# Altium project MIA_H_Bridge.PrjPcb
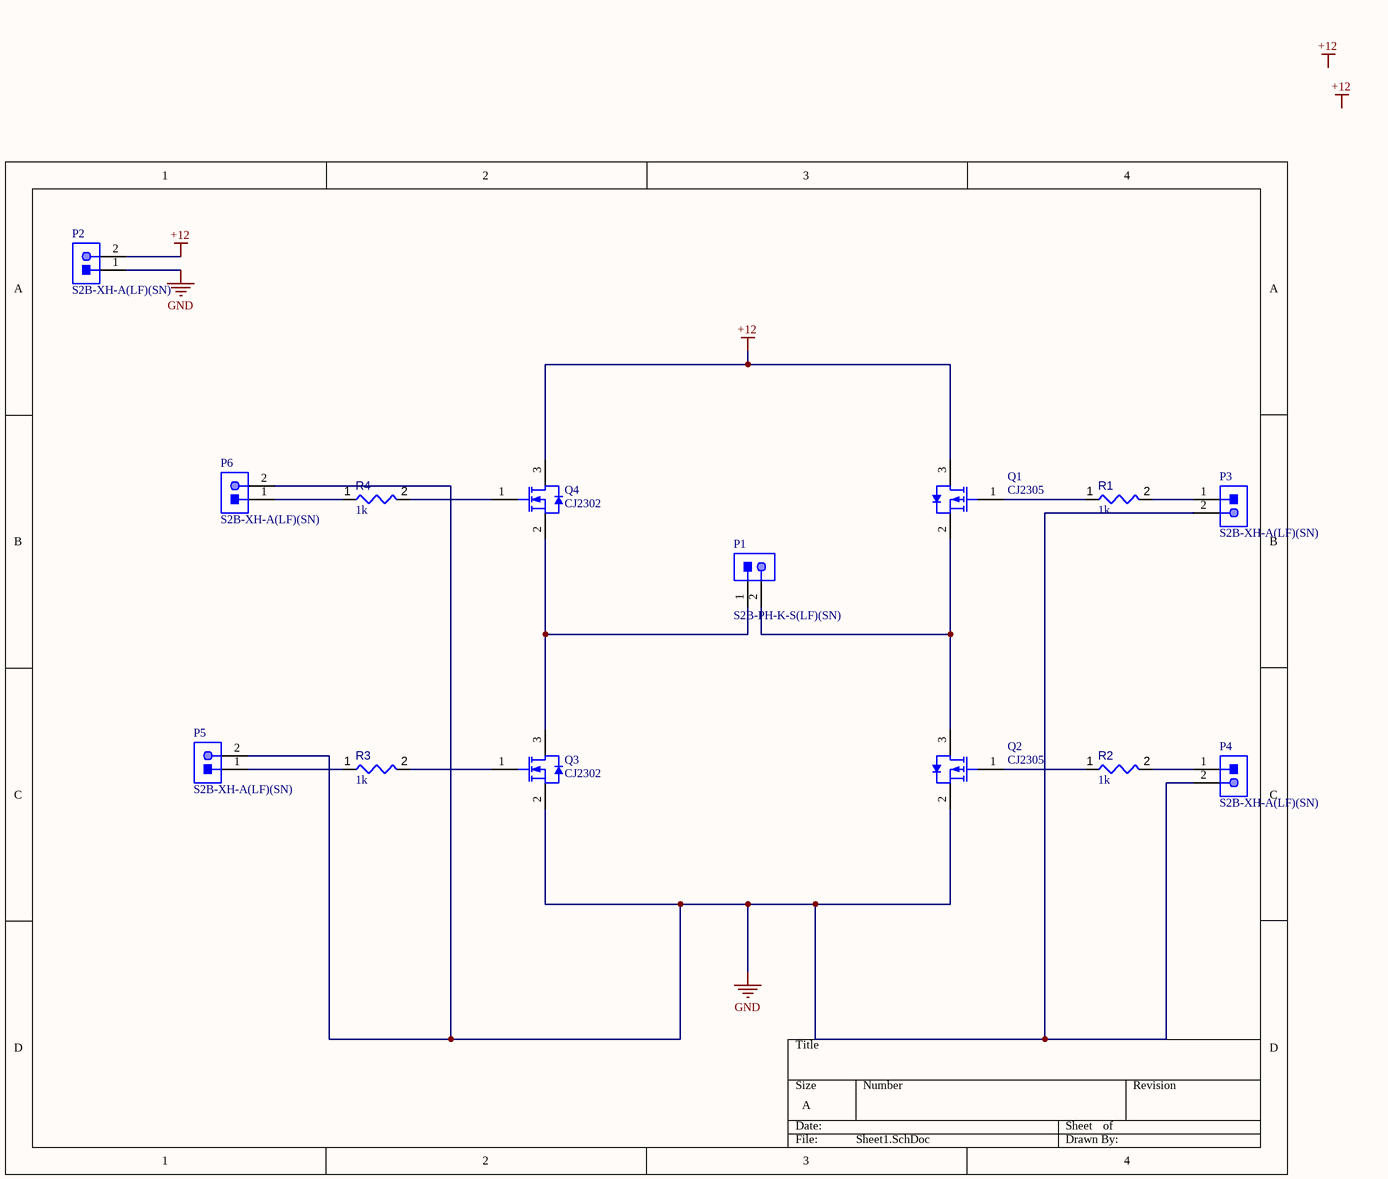
[diagram p0: Sheet1.SchDoc]
1 sheet, 14 parts. Net scope: global (net labels, ports and power ports of the same name join across sheets).
Board file: PCB1.PcbDoc

## Sheet Sheet1.SchDoc
size A; SheetNumber: 1; SheetTotal: 1

### Parts
P1  S2B-PH-K-S(LF)(SN)  [JST-S2B-PH-K-S_V]
P2  S2B-XH-A(LF)(SN)  [JST-S2B-XH-A(LF)(SN)_V]
P3  S2B-XH-A(LF)(SN)  [JST-S2B-XH-A(LF)(SN)_V]
P4  S2B-XH-A(LF)(SN)  [JST-S2B-XH-A(LF)(SN)_V]
P5  S2B-XH-A(LF)(SN)  [JST-S2B-XH-A(LF)(SN)_V]
P6  S2B-XH-A(LF)(SN)  [JST-S2B-XH-A(LF)(SN)_V]
Q1  CJ2305  [JSCJ-SOT23-3_V]
Q2  CJ2305  [JSCJ-SOT23-3_V]
Q3  CJ2302  [JSCJ-SOT23-3_V]
Q4  CJ2302  [JSCJ-SOT23-3_V]
R1  value 1k  [RESA60-630X240]  (hidden comment: MFR-25FBF52-10K)
R2  value 1k  [RESA60-630X240]  (hidden comment: MFR-25FBF52-10K)
R3  value 1k  [RESA60-630X240]  (hidden comment: MFR-25FBF52-10K)
R4  value 1k  [RESA60-630X240]  (hidden comment: MFR-25FBF52-10K)

### Nets
+12: P2.2 Q1.3(DRAIN) Q4.3(D)
GND: P2.1 P3.2 P4.2 P5.2 P6.2 Q2.2(SOURCE) Q3.2(S)
NetP1_1: P1.1 Q3.3(D) Q4.2(S)
NetP1_2: P1.2 Q1.2(SOURCE) Q2.3(DRAIN)
NetP3_1: P3.1 R1.2
NetP4_1: P4.1 R2.2
NetP5_1: P5.1 R3.1
NetP6_1: P6.1 R4.1
NetQ1_1: Q1.1(GATE) R1.1
NetQ2_1: Q2.1(GATE) R2.1
NetQ3_1: Q3.1(G) R3.2
NetQ4_1: Q4.1(G) R4.2

### Notes on the sheet
- Labels drawn without touching a wire or pin: +12

### Library data of the parts
P1 = CMP-002-00030-2: Male Header, Pitch 2 mm, 1 x 2 Position, Height 4.8 mm, Tail Length 3.4 mm, -25 to 85 degC, RoHS, Bulk; Manufacturer: Japan Solderless Terminals; Package Reference: S2B-PH-K-S; Case/Package: S2B-PH-K-S; Datasheet URL: http://www.jst-mfg.com/product/pdf/eng/ePH.pdf; RoHS Compliant: Unknown; Datasheet Version: Dec-12; Gender: Male; Min Operating Temperature: -25°C; Max Operating Temperature: 85°C; Package Description: Male Header, Pitch 2 mm, 1 x 2 Position, Height 4.8 mm, Tail Length 3.4 mm; Connector Type: Header; Mounting Technology: SM
P2-P6 = CMP-002-00032-2: Male Header, Pitch 2.5 mm, 1 x 2 Position, Height 6.1 mm, Tail Length 3.4 mm, -25 to 85 degC, RoHS, Bulk; Manufacturer: JST; Case/Package: S2B-XH-A(LF)(SN); Package Description: XH Series Disconnectable Crimp Style Connector, Pitch 2.5 mm, 1 x 2 Position, Height 6.1 mm, Tail Length 3.4 mm; Manufacturer URL: http://www.jst.com/home2.html; Datasheet URL: http://www.jst-mfg.com/product/pdf/eng/eXH.pdf; Connector Type: Header; Package Reference: S2B-XH-A(LF)(SN); Mounting Technology: TH; Max Operating Temperature: 85°C; Min Operating Temperature: -25°C; Datasheet Version: May-16; Gender: Male; RoHS Compliant: Unknown
Q1 Q2 = CMP-013-00015-3: P-Channel Plastic Encapsulate MOSFET, 12 V, 4.1 A, 3-Pin SOT23, Tape and Reel; Manufacturer: Jiangsu Changjiang Electronics Technology; Package Version: Rev. E, 09/2009; Datasheet URL: http://www.cj-elec.com/gallery/txUpfile/5140ba9ed47d18467ea4bddc055cd747.pdf; Case/Package: SOT23-3; Mounting Technology: SM; RoHS Compliant: Unknown; Datasheet Version: Rev. F, 04/2015; Package Description: 3-Pin Small Outline Transistor, Body 2.9 x 1.3 mm, Pitch 0.95 mm; Package Reference: SOT23-3
Q3 Q4 = CMP-013-00014-3: N-Channe Plastic Encapsulate MOSFET, 20 V, 2.1 A, 3-Pin SOT23, Tape and Reel; Manufacturer: Jiangsu Changjiang Electronics Technology; Package Version: Rev. E, 09/2009; Package Reference: SOT23-3; Mounting Technology: SM; Datasheet Version: Rev. D, 08/2015; RoHS Compliant: Unknown; Package Description: 3-Pin Small Outline Transistor, Body 2.9 x 1.3 mm, Pitch 0.95 mm; Datasheet URL: http://www.cj-elec.com/gallery/txUpfile/9c19fa03e8d43801a6647d386a41a240.pdf; Case/Package: SOT23-3
R1-R4 = CMP-009-00047-4: Axial Resistor, 10 KOhm, +/- 1%, 0.25 W, -55 to 155 degC, 2-Pin THD, RoHS, Bulk; Manufacturer: Yageo; Power: 250mW; Voltage Rating: 250V; Manufacturer URL: http://www.yageo.com/; Datasheet URL: http://www.yageo.com/documents/recent/Yageo%20LR_MFR_2013.pdf; Package Reference: MFR-25; Min Operating Temperature: -55°C; Mounting Technology: TH; Package Quantity: 200; Case/Package: Axial; Tolerance: 1%; RoHS Compliant: True; Datasheet Version: Apr-13; Packaging: Bulk; Max Operating Temperature: 155°C; Package Description: 2-Pin Axial Lead, Dia 2.4 mm, Body Length 6.3 mm